# EAGLE schematic Schematic (EAGLE 7.7.0)
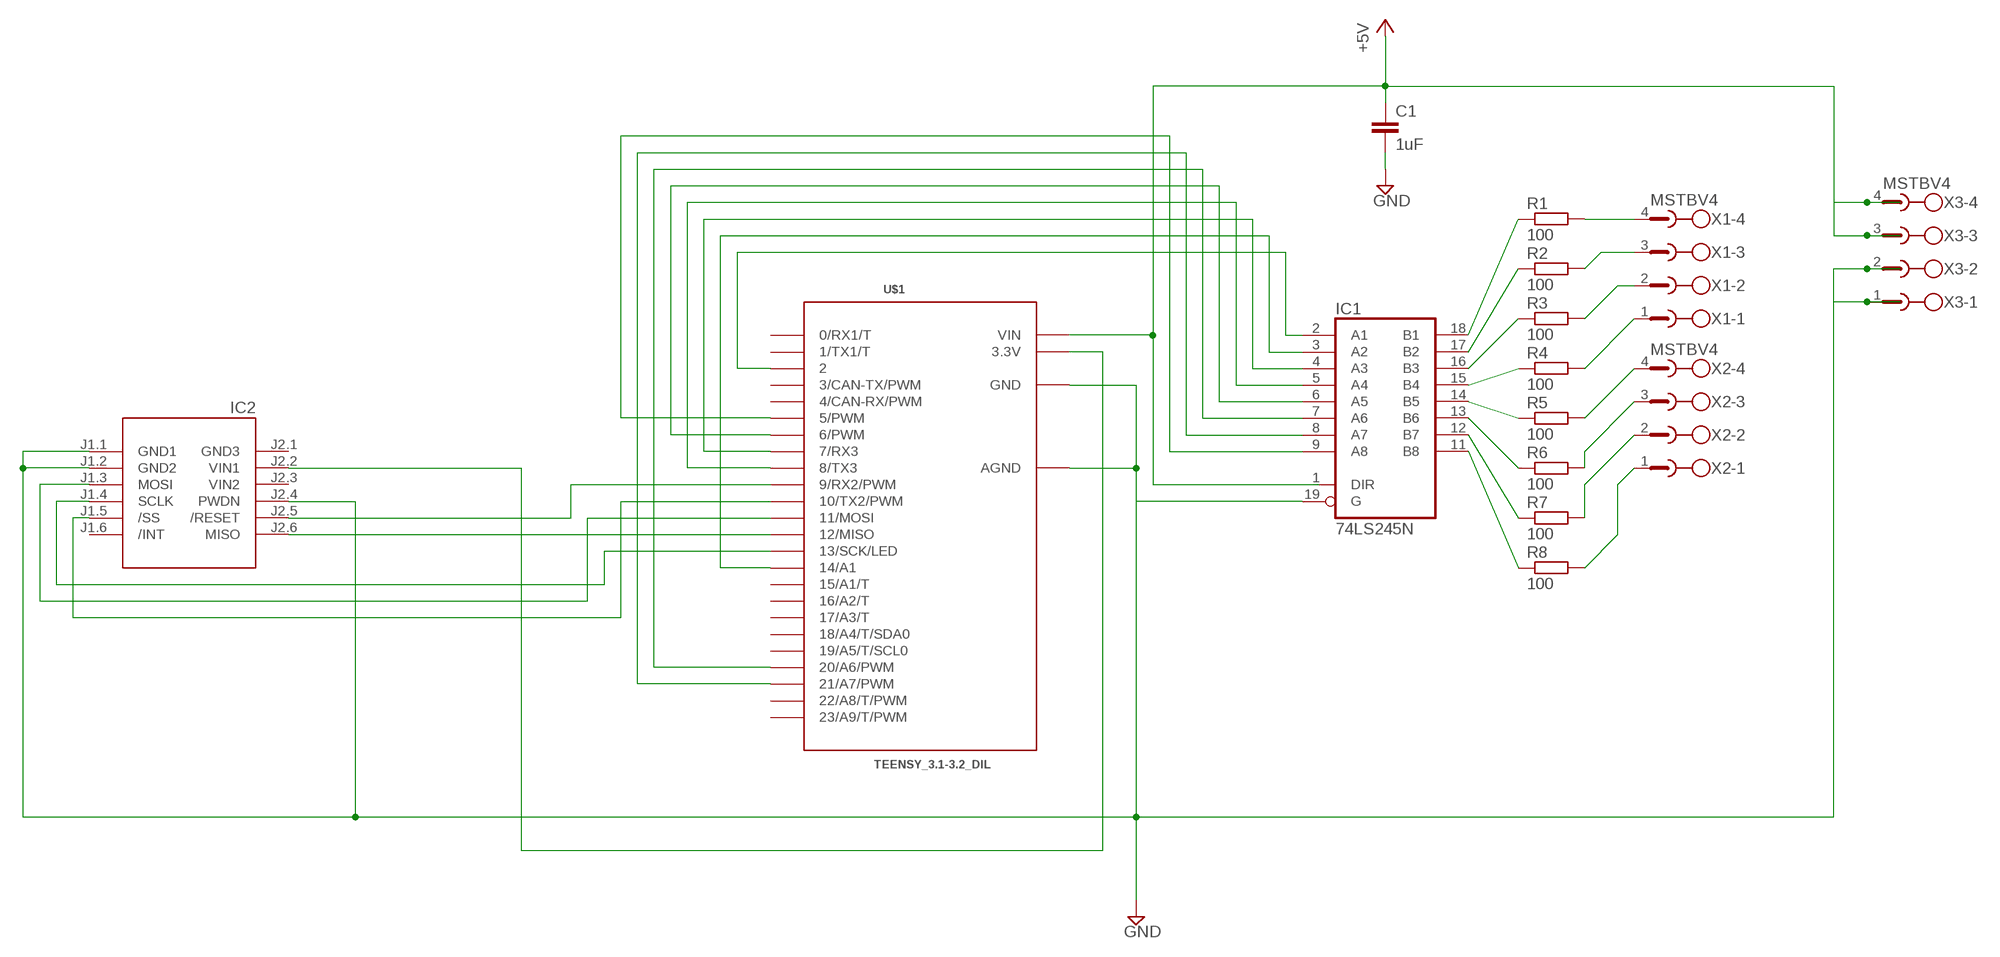
[diagram p0: schematic, sheet 1]

## Parts
C1  1uF  C-EU050-035X075  [C050-035X075]
IC1  74LS245N  [DIL20]
IC2  WIZ820IO_DEVICE'DUAL-IN-LINE'  [WIZ820IO]
R1  100  R-EU_0207/7  [0207/7]
R2  100  R-EU_0207/7  [0207/7]
R3  100  R-EU_0207/7  [0207/7]
R4  100  R-EU_0207/7  [0207/7]
R5  100  R-EU_0207/7  [0207/7]
R6  100  R-EU_0207/7  [0207/7]
R7  100  R-EU_0207/7  [0207/7]
R8  100  R-EU_0207/7  [0207/7]
U$1  TEENSY_3.1-3.2_DIL  [TEENSY_3.0-3.2&LC_DIL]
X1  MSTBV4  [MSTBV4]
X2  MSTBV4  [MSTBV4]
X3  MSTBV4  [MSTBV4]

## Nets
+5V: C1.1 U$1.VIN X3.3 X3.4
GND: C1.2 IC1.19(G) IC2.J1.1(GND1) IC2.J1.2(GND2) IC2.J2.4(PWDN) U$1.AGND U$1.GND X3.1 X3.2
N$1: IC1.18(B1) R1.1
N$2: IC1.17(B2) R2.1
N$3: IC1.16(B3) R3.1
N$4: IC1.15(B4) R4.1
N$5: IC1.14(B5) R5.1
N$6: IC1.13(B6) R6.1
N$7: IC1.12(B7) R7.1
N$8: IC1.11(B8) R8.1
N$9: IC1.2(A1) U$1.2
N$10: IC1.3(A2) U$1.14/A0(14/A1)
N$11: IC1.4(A3) U$1.7(7/RX3)
N$12: IC1.5(A4) U$1.8(8/TX3)
N$13: IC1.6(A5) U$1.6(6/PWM)
N$14: IC1.7(A6) U$1.20/A6(20/A6/PWM)
N$15: IC1.8(A7) U$1.21/A7(21/A7/PWM)
N$16: IC1.9(A8) U$1.5(5/PWM)
N$18: IC2.J2.2(VIN1) U$1.3.3V
N$19: IC2.J2.5(/RESET) U$1.9(9/RX2/PWM)
N$20: IC2.J2.6(MISO) U$1.12(12/MISO)
N$21: IC2.J1.3(MOSI) U$1.11(11/MOSI)
N$22: IC2.J1.4(SCLK) U$1.13(13/SCK/LED)
N$23: IC2.J1.5(/SS) U$1.10(10/TX2/PWM)
N$24: R1.2 X1.4
N$25: R2.2 X1.3
N$26: R3.2 X1.2
N$27: R4.2 X1.1
N$28: R5.2 X2.4
N$29: R6.2 X2.3
N$30: R7.2 X2.2
N$31: R8.2 X2.1
Unconnected: IC1.1(DIR) IC2.J1.6(/INT) U$1.0(0/RX1/T) U$1.1(1/TX1/T) U$1.3(3/CAN-TX/PWM) U$1.4(4/CAN-RX/PWM) U$1.15/A1(15/A1/T) U$1.16/A2(16/A2/T) U$1.17/A3(17/A3/T) U$1.18/A4(18/A4/T/SDA0) U$1.19/A5(19/A5/T/SCL0) U$1.22/A8(22/A8/T/PWM) U$1.23/A9(23/A9/T/PWM)

## Power pins joined to a net without a drawn wire
GND: IC1.10(GND)
GND3: IC2.J2.1(GND3)
VCC: IC1.20(VCC)
VIN2: IC2.J2.3(VIN2)

## Library data of the parts
C1 = resistor:C-EU: CAPACITOR, European symbol
IC1 = 74xx-us:74*245: Octal BUS TRANSCEIVER, 3-state
IC2 = Wiz820io:WIZ820IO_DEVICE: WIZnet, WIZ820io plug in module incl. W5200 chip and MagJack
R1-R8 = resistor:R-EU_: RESISTOR, European symbol
U$1 = Teensy_3_and_LC_Series_Boards_v1.4:TEENSY_3.1-3.2_DIL: Teensy 3.1 or 3.2 in a DIL Layout.
X1-X3 = con-phoenix-508:MSTBV4: PHOENIX; MPN: MSTBV 2,5/4-GF-5.08; OC_FARNELL: 1792794; OC_NEWARK: 69R9847